# Altium schematic sheet RPi_DAQ_Hat_InputConditioning.SchDoc
size A
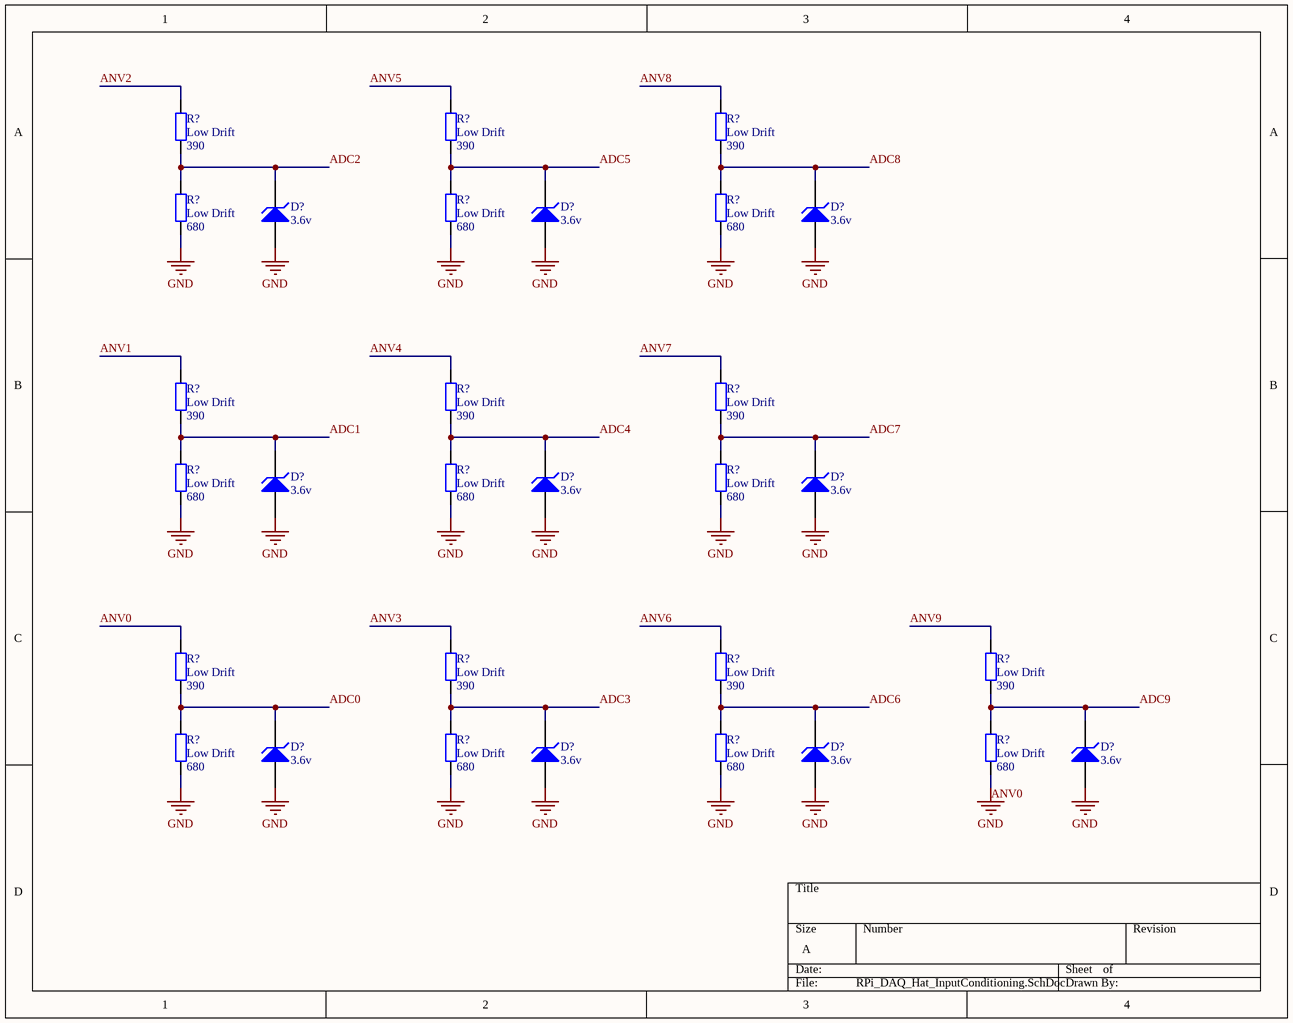
[diagram p0: RPi_DAQ_Hat_InputConditioning.SchDoc]

## Parts
(Parts that share a designator on the sheet are numbered #1, #2 ... from top to bottom, then left to right.)
D?#1  3.6v  [DIODE-0.7]
D?#2  3.6v  [DIODE-0.7]
D?#3  3.6v  [DIODE-0.7]
D?#4  3.6v  [DIODE-0.7]
D?#5  3.6v  [DIODE-0.7]
D?#6  3.6v  [DIODE-0.7]
D?#7  3.6v  [DIODE-0.7]
D?#8  3.6v  [DIODE-0.7]
D?#9  3.6v  [DIODE-0.7]
D?#10  3.6v  [DIODE-0.7]
R?#1  Low Drift  value 390  [R0805]
R?#2  Low Drift  value 390  [R0805]
R?#3  Low Drift  value 390  [R0805]
R?#4  Low Drift  value 680  [R0805]
R?#5  Low Drift  value 680  [R0805]
R?#6  Low Drift  value 680  [R0805]
R?#7  Low Drift  value 390  [R0805]
R?#8  Low Drift  value 390  [R0805]
R?#9  Low Drift  value 390  [R0805]
R?#10  Low Drift  value 680  [R0805]
R?#11  Low Drift  value 680  [R0805]
R?#12  Low Drift  value 680  [R0805]
R?#13  Low Drift  value 390  [R0805]
R?#14  Low Drift  value 390  [R0805]
R?#15  Low Drift  value 390  [R0805]
R?#16  Low Drift  value 390  [R0805]
R?#17  Low Drift  value 680  [R0805]
R?#18  Low Drift  value 680  [R0805]
R?#19  Low Drift  value 680  [R0805]
R?#20  Low Drift  value 680  [R0805]

## Nets
GND: D?#1.1(A) D?#2.1(A) D?#3.1(A) D?#4.1(A) D?#5.1(A) D?#6.1(A) D?#7.1(A) D?#8.1(A) D?#9.1(A) D?#10.1(A) R?#4.1 R?#5.1 R?#6.1 R?#10.1 R?#11.1 R?#12.1 R?#17.1 R?#18.1 R?#19.1 R?#20.1
ADC0: D?#7.2(K) R?#13.1 R?#17.2
ADC1: D?#4.2(K) R?#7.1 R?#10.2
ADC2: D?#1.2(K) R?#1.1 R?#4.2
ADC3: D?#8.2(K) R?#14.1 R?#18.2
ADC4: D?#5.2(K) R?#8.1 R?#11.2
ADC5: D?#2.2(K) R?#2.1 R?#5.2
ADC6: D?#9.2(K) R?#15.1 R?#19.2
ADC7: D?#6.2(K) R?#9.1 R?#12.2
ADC8: D?#3.2(K) R?#3.1 R?#6.2
ADC9: D?#10.2(K) R?#16.1 R?#20.2
ANV0: R?#13.2
ANV1: R?#7.2
ANV2: R?#1.2
ANV3: R?#14.2
ANV4: R?#8.2
ANV5: R?#2.2
ANV6: R?#15.2
ANV7: R?#9.2
ANV8: R?#3.2
ANV9: R?#16.2

## Notes on the sheet
- Labels drawn without touching a wire or pin: ANV0

## Library data of the parts
D?#1-D?#10 = D Zener: Zener Diode; Published: 8-Jun-2000; LatestRevisionDate: 17-Jul-2002; LatestRevisionNote: Re-released for DXP Platform.; PackageReference: DIODE-0.7; Publisher: Altium Limited; PackageDescription: Diode, Thru-Hole; 2 Leads; 0.7 in Pin Spacing
R?#1-R?#20 = Res2: Resistor; Published: 8-Jun-2000; LatestRevisionDate: 17-Jul-2002; LatestRevisionNote: Re-released for DXP Platform.; PackageReference: AXIAL-0.4; Publisher: Altium Limited; PackageDescription: Axial Device, Thru-Hole; 2 Leads; 0.4 in Pin Spacing